# Altium schematic sheet usbasp.SchDoc
size A
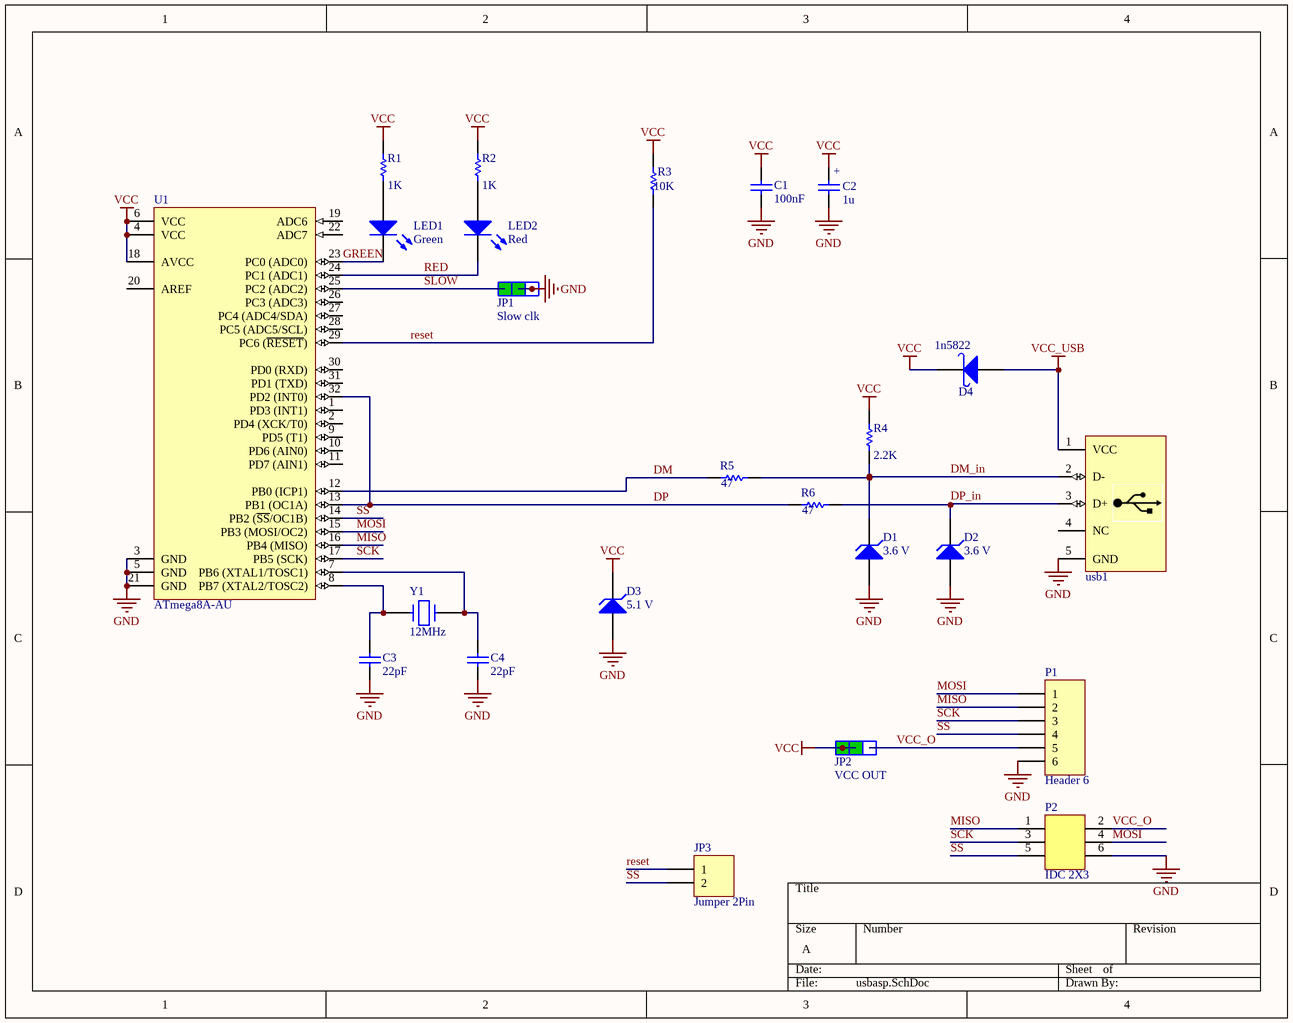
[diagram p0: usbasp.SchDoc]

## Parts
C1  value 100nF  [cap0603]  (hidden comment: Cap)
C2  value 1u  [cap0603]  (hidden comment: Cap)
C3  value 22pF  [cap0603]  (hidden comment: Cap)
C4  value 22pF  [cap0603]  (hidden comment: Cap)
D1  Voltage: 3.6 V  [Diode 1n4148 SMD]  (hidden comment: Diode Zener)
D2  Voltage: 3.6 V  [Diode 1n4148 SMD]  (hidden comment: Diode Zener)
D3  Voltage: 5.1 V  [Diode 1n4148 SMD]  (hidden comment: Diode Zener)
D4  1n5822  [DO-214AC(SMA)]
JP1  Slow clk  [jumper selector]
JP2  VCC OUT  [jumper selector]
JP3  Jumper 2Pin  [PCBComponent_1]
LED1  Green  [LED_0603 G]
LED2  Red  [LED_0603 R]
P1  Header 6  [HDR1X6]
P2  IDC 2X3  [IDC Socket Male 6pin Straight THT Goldplated 2_54mm]
R1  1K  [RES0603]
R2  1K  [RES0603]
R3  10K  [RES0603]
R4  2.2K  [RES0603]
R5  47  [RES0603]
R6  47  [RES0603]
U1  ATmega8A-AU  [TQFP32_N]
usb1  USB Connector  [USB_AB_BM_SHS]  (value not drawn)
Y1  12MHz  [CRYSTAL Small]

## Nets
GND: C1.1 C2.- C3.1 C4.1 D1.1(A) D2.1(A) D3.1(A) JP1.2 JP1.3 P1.6 P2.6 U1.3(GND) U1.5(GND) U1.21(GND) usb1.5(GND)
VCC: C1.2 C2.+ D3.2(K) D4.2(K) JP2.1 JP2.2 R1.2 R2.2 R3.2 R4.2 U1.4(VCC) U1.6(VCC) U1.18(AVCC)
VCC_USB: D4.1(A) usb1.1(VCC)
DM: R5.1 U1.12(PB0_(ICP1))
DM_in: D1.2(K) R4.1 R5.2 usb1.2(D-)
DP: R6.1 U1.13(PB1_(OC1A)) U1.32(PD2_(INT0))
DP_in: D2.2(K) R6.2 usb1.3(D+)
GREEN: LED1.2(K) U1.23(PC0_(ADC0))
MISO: P1.2 P2.1 U1.16(PB4_(MISO))
MOSI: P1.1 P2.4 U1.15(PB3_(MOSI/OC2))
RED: LED2.2(K) U1.24(PC1_(ADC1))
reset: JP3.1 R3.1 U1.29(PC6_(~{RESET}))
SCK: P1.3 P2.3 U1.17(PB5_(SCK))
SLOW: JP1.1 U1.25(PC2_(ADC2))
SS: JP3.2 P1.4 P2.5 U1.14(PB2_(~{SS}/OC1B))
VCC_O: JP2.3 P1.5 P2.2
NetC3_2: C3.2 U1.8(PB7_(XTAL2/TOSC2)) Y1.2
NetC4_2: C4.2 U1.7(PB6_(XTAL1/TOSC1)) Y1.1
NetLED1_1: LED1.1(A) R1.1
NetLED2_1: LED2.1(A) R2.1

Not connected (* = marked no-connect by the designer): U1 1(PD3_(INT1)) 2(PD4_(XCK/T0)) 9(PD5_(T1)) 10(PD6_(AIN0)) 11(PD7_(AIN1)) 19(ADC6) 20(AREF) 22(ADC7) 26(PC3_(ADC3)) 27(PC4_(ADC4/SDA)) 28(PC5_(ADC5/SCL)) 30(PD0_(RXD)) 31(PD1_(TXD)); usb1 4(NC)

## Library data of the parts
C1 C3 C4 = Cap ceramic: =value
C2 = Cap Pol: CAP-3300Uf; pin to pad: +>1 ->2
D1-D3 = Diode Zener: Zener Diode; Designer: Saeid Jorablo; Company: E.P.I.L; Design Date: 2011/11/02
D4 = 1N5822 SMD: Schottky Rectifiers; Part. No: SS34; Manufacturer: ON Semiconductor/Fairchild; Designer: Abbas Basereh; Link: https://www.aliexpress.com/item/Free-shipping-100pcs-1n5822-sma-smd-do-214ac-Schottky-diode-ss34/32337482329.html?spm=2114.01010208.3.1.zLZDsP&ws_ab_test=searchweb0_0,searchweb201602_4_10065_10068_10084_10083_10080_10082_10081_10060_10061_10062_10056_10055_10054_10059_10099_10078_10079_427_10073_10103_10102_10096_10052_10050_10051,searchweb201603_4&btsid=6e50dc92-ac69-45bc-a19e-209af19ce602; Link: http://www.tme.eu/en/details/ss34/smd-schottky-diodes/vishay/ss34-e357t/; Link: http://www.digikey.com/product-detail/en/on-semiconductor-fairchild/SS34/SS34FSCT-ND/2094459; Data: 16-12-2016
JP1 JP2 = Jumper Selector
JP3 = Jumper 2Pin: Jumper, 2-Pin; Designer: Abbas Basereh; Data: 16-12-2016; Link: *
LED1 LED2 = LED0: Typical INFRARED GaAs LED; Published: 8-Jun-2000; LatestRevisionDate: 08-Jul-2005; LatestRevisionNote: Mech Layer 1 removed.; PackageReference: LED-0; Publisher: Altium Limited; PackageDescription: LED; 2 Leads
P1 = Header 6: Header, 6-Pin; LatestRevisionDate: 17-Jul-2002; LatestRevisionNote: Re-released for DXP Platform.; Publisher: Altium Limited
R1-R6 = Res1: Resistor; Published: 8-Jun-2000; LatestRevisionDate: 17-Jul-2002; LatestRevisionNote: Re-released for DXP Platform.; PackageReference: AXIAL-0.3; Publisher: Altium Limited; PackageDescription: Axial Device, Thru-Hole; 2 Leads; 0.3 in Pin Spacing
  R1 R2: Value: 1K
  R3: Value: 10K
  R4: Value: 2.2K
  R5 R6: Value: 47
U1 = ATmega8A-AU: 8-bit AVR Microcontroller, 8KB Flash, 512 Bytes EEPROM, 1KB SRAM, 32-pin TQFP, Industrial Grade (-40°C to 85°C); Published: 1-Apr-2010; DatasheetVersion: revC, Jul-2009; PackageVersion: revB, Oct-2001; PackageReference: 32A; Publisher: Altium Limited; PackageDescription: 32-Lead, 7x7x1.0 mm Body, 0.8mm Lead Pitch, Thin Profile Plastic Quad Flat Package (TQFP); Supplier 1: Digi-Key; Supplier Part Number 1: ATMEGA8A-AU-ND; Supplier 2: Farnell; Supplier Part Number 2: 1748532; Supplier 3: Mouser; Supplier Part Number 3: 556-ATMEGA8A-AU; Code_JEDEC: MS-026-ABA; ComponentLink1Description: Manufacturer Link; ComponentLink1URL: http://www.atmel.com/products/avr/default.asp?; ComponentLink2Description: ATmega8A Datasheet; ComponentLink2URL: http://www.atmel.com/dyn/resources/prod_documents/doc8159.pdf; ComponentLink3Description: ATmega8A Summary; ComponentLink3URL: http://www.atmel.com/dyn/resources/prod_documents/8159S.pdf; ComponentLink4Description: Atmel.com Home; ComponentLink4URL: http://www.atmel.com
usb1 = USB MICRO: USB Connector MICRO-B Type; Designer: ABBAS BASEREH; Max Current: 1600mA; Mounting Technology: Surface Mount\Through-Hole; Category: Connector; Pin Count: 5-7; Publisher: ABBAS BASEREH; Status: Unreleased; ComponentLink1Description: Datasheet; ComponentLink2Description: Reference; Update: 1395-11-17
Y1 = CRYSTAL